# Altium schematic sheet MCU.SchDoc
size A4
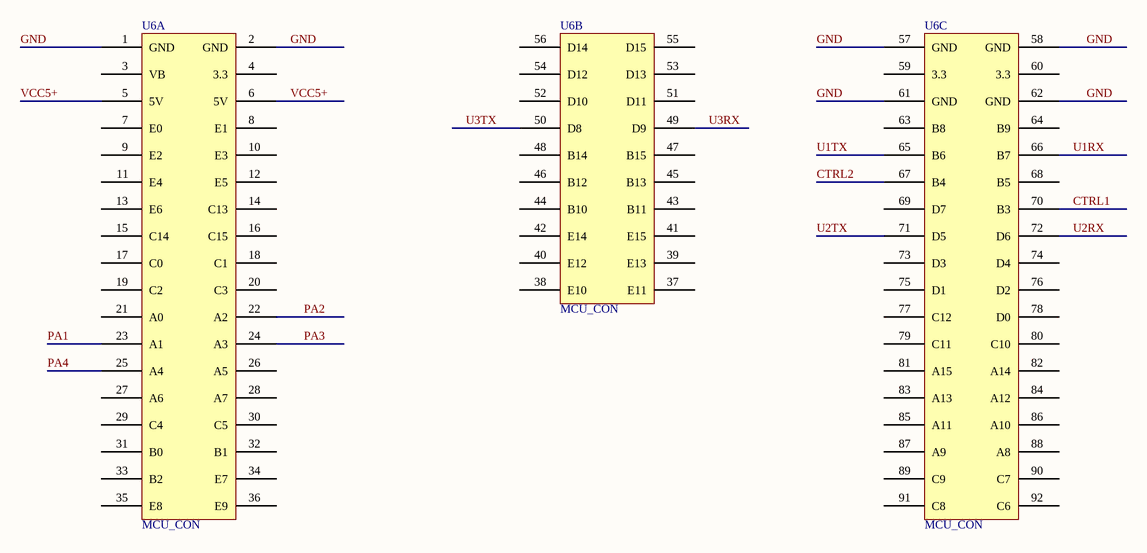
[diagram p0: MCU.SchDoc]

## Parts
U6  MCU_CON  [MCU_CON]  (parts A,B,C of 3)

## Nets
CTRL1: U6.70(B3)
CTRL2: U6.67(B4)
GND: U6.1(GND) U6.2(GND) U6.57(GND) U6.58(GND) U6.61(GND) U6.62(GND)
PA1: U6.23(A1)
PA2: U6.22(A2)
PA3: U6.24(A3)
PA4: U6.25(A4)
U1RX: U6.66(B7)
U1TX: U6.65(B6)
U2RX: U6.72(D6)
U2TX: U6.71(D5)
U3RX: U6.49(D9)
U3TX: U6.50(D8)
VCC5+: U6.5(5V) U6.6(5V)

Not connected (* = marked no-connect by the designer): U6 3(VB) 4(3.3) 7(E0) 8(E1) 9(E2) 10(E3) 11(E4) 12(E5) 13(E6) 14(C13) 15(C14) 16(C15) 17(C0) 18(C1) 19(C2) 20(C3) 21(A0) 26(A5) 27(A6) 28(A7) 29(C4) 30(C5) 31(B0) 32(B1) 33(B2) 34(E7) 35(E8) 36(E9) 37(E11) 38(E10) 39(E13) 40(E12) 41(E15) 42(E14) 43(B11) 44(B10) 45(B13) 46(B12) 47(B15) 48(B14) 51(D11) 52(D10) 53(D13) 54(D12) 55(D15) 56(D14) 59(3.3) 60(3.3) 63(B8) 64(B9) 68(B5) 69(D7) 73(D3) 74(D4) 75(D1) 76(D2) 77(C12) 78(D0) 79(C11) 80(C10) 81(A15) 82(A14) 83(A13) 84(A12) 85(A11) 86(A10) 87(A9) 88(A8) 89(C9) 90(C7) 91(C8) 92(C6)